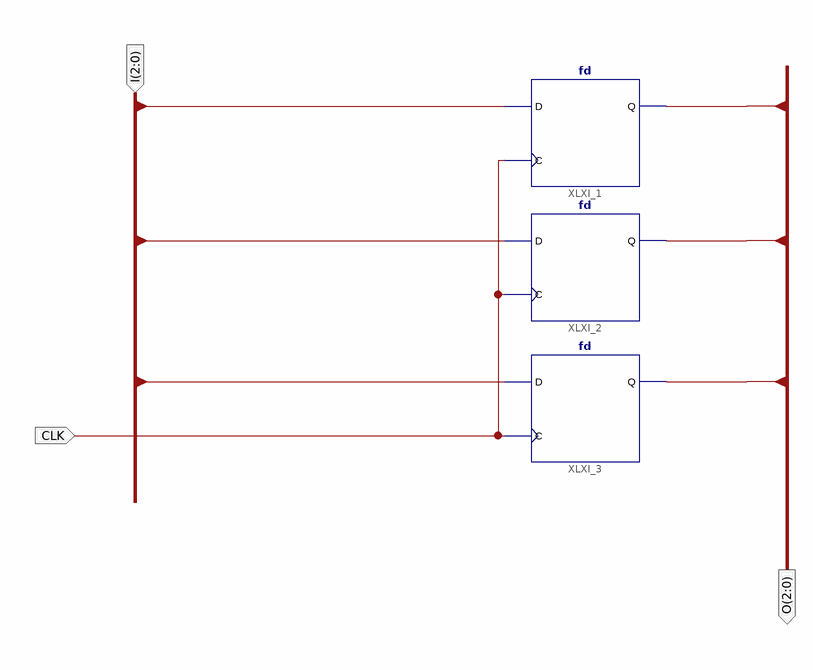
[diagram p0: schematic sheet 1]
// Xilinx ISE schematic FD_3.sch (spartan3e) as structural Verilog: 3 symbols, 3 ports
module FD_3 (
  input  CLK,
  input  [2:0] I,
  output [2:0] O
);

  fd XLXI_1 (.C(CLK), .D(I[0]), .Q(O[0]));
  fd XLXI_2 (.C(CLK), .D(I[1]), .Q(O[1]));
  fd XLXI_3 (.C(CLK), .D(I[2]), .Q(O[2]));
endmodule
